# EAGLE design Executive_230V_B (EAGLE 9.5.1)
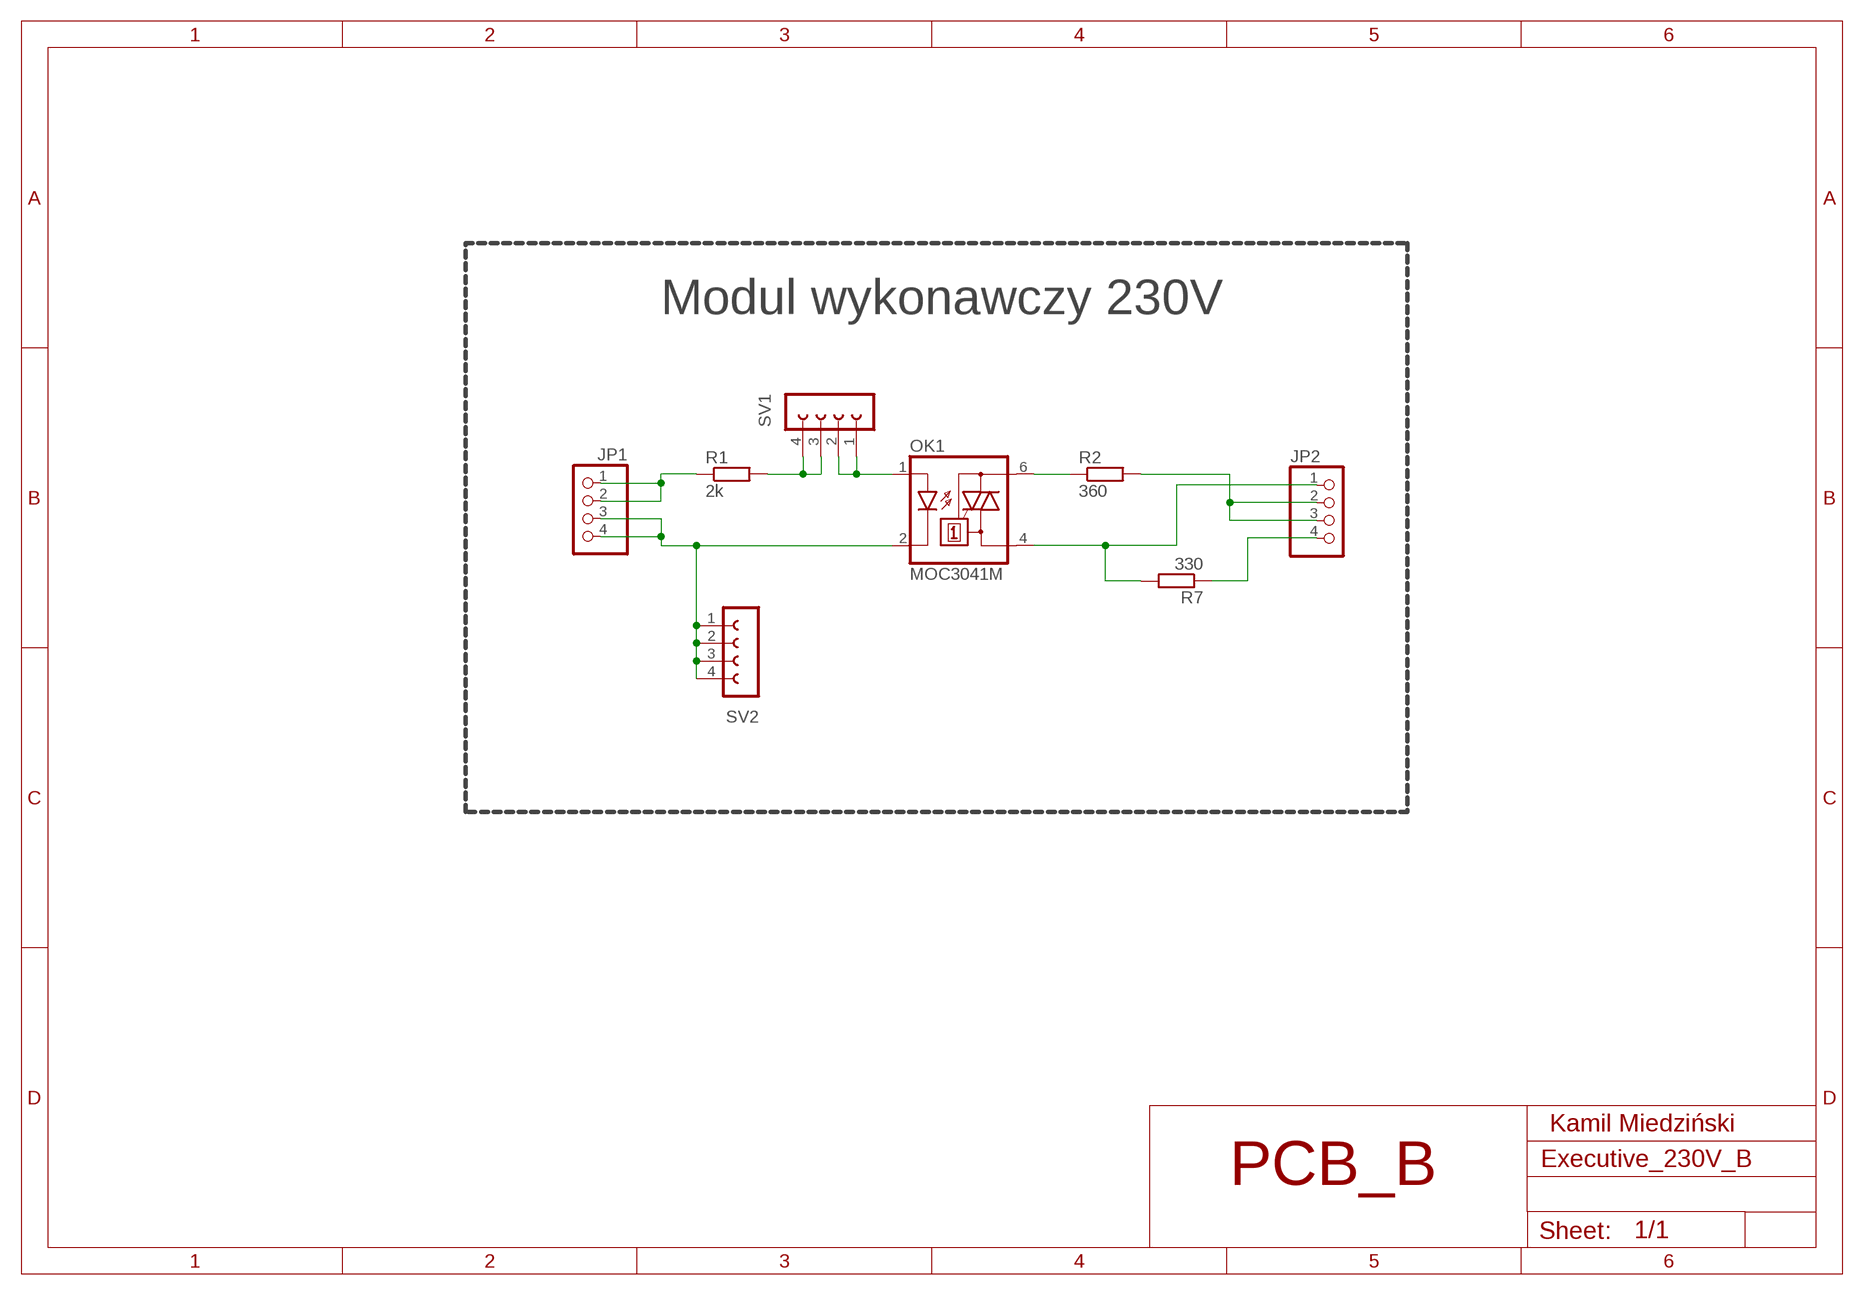
[diagram p0: schematic, sheet 1]

## Parts
JP1  PINHD-1X41X04H  [1X04H]
JP2  PINHD-1X41X04H  [1X04H]
OK1  MOC3041M  [DIL06]
R1  2k  R-EU_0207/10  [0207/10]
R2  360  R-EU_0207/10  [0207/10]
R7  330  R-EU_0207/10  [0207/10]
SV1  FE04-1  [FE04-1]
SV2  FE04-1  [FE04-1]

## Nets
N$1: JP1.3 JP1.4 OK1.2(C) SV2.1 SV2.2 SV2.3 SV2.4
N$2: JP1.1 JP1.2 R1.1
N$3: R1.2 SV1.3 SV1.4
N$4: OK1.1(A) SV1.1 SV1.2
N$5: OK1.6(A2) R2.1
N$6: JP2.4 R7.1
N$8: JP2.1 OK1.4(A1) R7.2
N$9: JP2.2 JP2.3 R2.2

## Notes on the sheet
- Modul wykonawczy 230V
- Kamil Miedziński
- PCB_B

## Library data of the parts
JP1 JP2 = pinhead:PINHD-1X4: PIN HEADER
OK1 = optocoupler:MOC30*: 6-Pin DIP Zero-Cross Optoisolators Triac Driver Output (250/400 Volt Peak) Source: Data sheet <http://www.fairchildsemi.com/ds/MO/MOC3031M.pdf> The old path of data sheet not more available 2013-05-06.; MF: FAIRCHILD SEMICONDUCTOR; MPN: MOC3041M; OC_FARNELL: 1086677; OC_NEWARK: 78K6090
R1 R7 = rcl:R-EU_: RESISTOR, European symbol; OC_FARNELL: unknown; SPICEPREFIX: R
R2 = rcl:R-EU_: RESISTOR, European symbol; MF: TT ELECTRONICS / WELWYN; MPN: MFR4-360RFI; OC_FARNELL: 1099880; SPICEPREFIX: R
SV1 SV2 = con-lsta:FE04-1: FEMALE HEADER; OC_FARNELL: unknown; OC_NEWARK: unknown

## Board
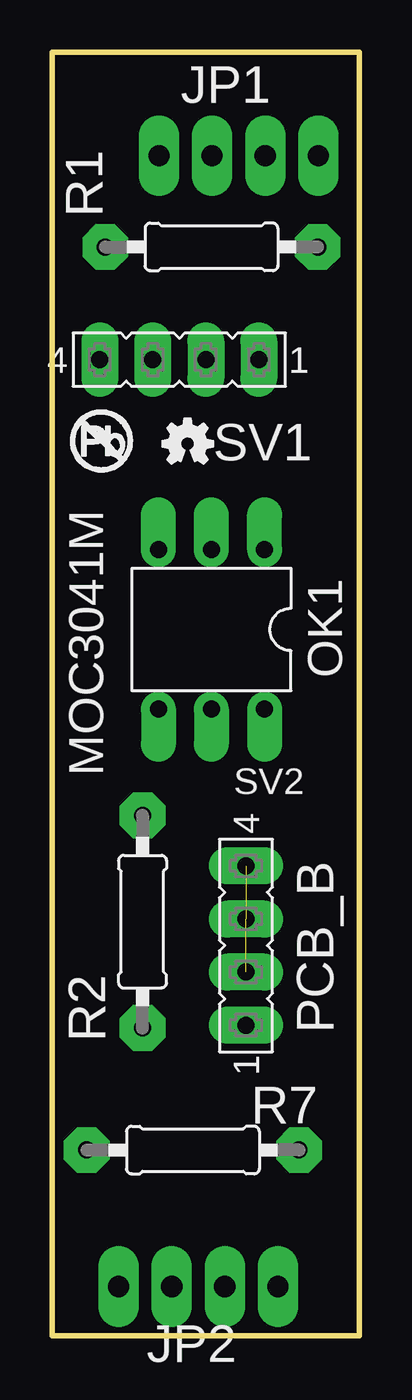
[diagram p1: board, top side]
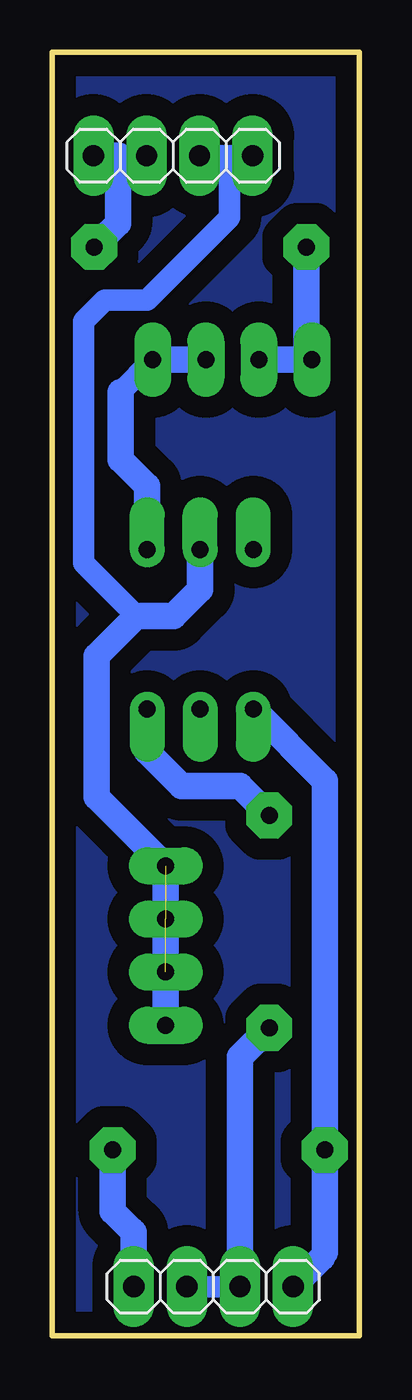
[diagram p2: board, bottom side, seen from below]

Size 14.7 x 61.38 mm. Coordinates in mm from the lower left corner, seen from the top.
Outline: 14.7,0 14.7,61.38 0,61.38 0,0 14.7,0
Copper layers (1*16): Top 0.035mm / dielectric 1.5mm / Bottom 0.035mm
Design rules "default": minimum track width 6mil, minimum drill 0.35mm, track to track 6mil, track to pad 6mil, pad to pad 6mil, via to via 6mil, smd to smd 6mil, copper to edge 40mil, drill to drill 6mil, minimum pad ring 10mil, minimum via ring 8mil, stop-mask expansion 4mil, vias tented up to drill 0mil, thermal gap 10mil

### Footprints (pad centres in the part's own frame; a part is rotated, then mirrored left to right if it is on the bottom)
1X04H = drill 1.016 pad 1.93 long: 1 -3.81,0; 2 -1.27,0; 3 1.27,0; 4 3.81,0
DIL06 = drill 0.813 pad 1.676 offset: 1 -2.54,-3.81; 2 0,-3.81; 3 2.54,-3.81; 4 2.54,3.81; 5 0,3.81; 6 -2.54,3.81
0207/10 = drill 0.813 pad 2.184 octagon: 1 -5.08,0; 2 5.08,0
FE04-1 = drill 0.813 pad 1.778 long: 1 -3.81,0; 2 -1.27,0; 3 1.27,0; 4 3.81,0

### Placement (x,y rotation side)
JP1  8.92,56.43 0 bottom
JP2  6.99,2.36 180 bottom
OK1  7.62,33.78 180 top
R1  7.62,52.07 180 top
R2  4.32,19.81 270 top
R7  6.73,8.89 180 top
SV1  6.08,46.68 180 top
SV2  9.27,18.67 90 top
U$1  [OSHW-LOGO-MINI]  6.48,42.67 0 top
U$2  [NO_PB_LOGO_0.120]  0.64,40.89 0 top

### Tracks (layer width: path | path; a pad name or v marks a point on that pad's centre or on a via)
N$1  (2 unrouted)
  Bottom 1.016: JP1.4 JP1.3 6.22,56.43 6.22,53.47 10.16,49.53 12.19,49.53 13.21,48.51 13.21,36.96 10.67,34.42
  Bottom 1.27: OK1.2 7.62,35.69 8.89,34.42 10.67,34.42 12.57,32.51 12.57,25.78 SV2.4 SV2.1
N$2
  Bottom 1.016: JP1.2 JP1.1
  Bottom 1.27: R1.1 11.56,53.21 11.56,56.29 11.58,56.31 11.52,56.43 JP1.1
N$3
  Bottom 1.27: R1.2 2.54,46.95 SV1.4 SV1.3
N$4
  Bottom 1.016: SV1.1 11.43,45.14
  Bottom 1.27: SV1.2 SV1.1 | 11.43,45.14 11.43,41.91 10.16,40.64 OK1.1
N$5
  Bottom 1.016: OK1.6 10.16,27.94
  Bottom 1.27: 10.16,27.94 8.51,26.29 5.71,26.29 R2.1
N$6
  Bottom 1.016: 10.8,4.97 10.97,5.08 10.92,5.08
  Bottom 1.27: JP2.4 10.8,4.97 | 10.92,5.08 11.81,5.97 R7.1
N$7
  pour Bottom (isolate 1.016): 0,61.38 0,0 14.7,0 14.7,61.38
N$8
  Bottom 1.016: 1.79,3.75 1.65,4.01
  Bottom 1.27: OK1.4 1.65,26.54 R7.2 1.65,4.01 | JP2.1 1.79,3.75
N$9
  Bottom 1.016: 5.71,2.49 5.72,2.48 JP2.2 JP2.3
  Bottom 1.27: R2.2 5.71,13.34 5.71,2.49

### Text on the board
tNames: PCB_B